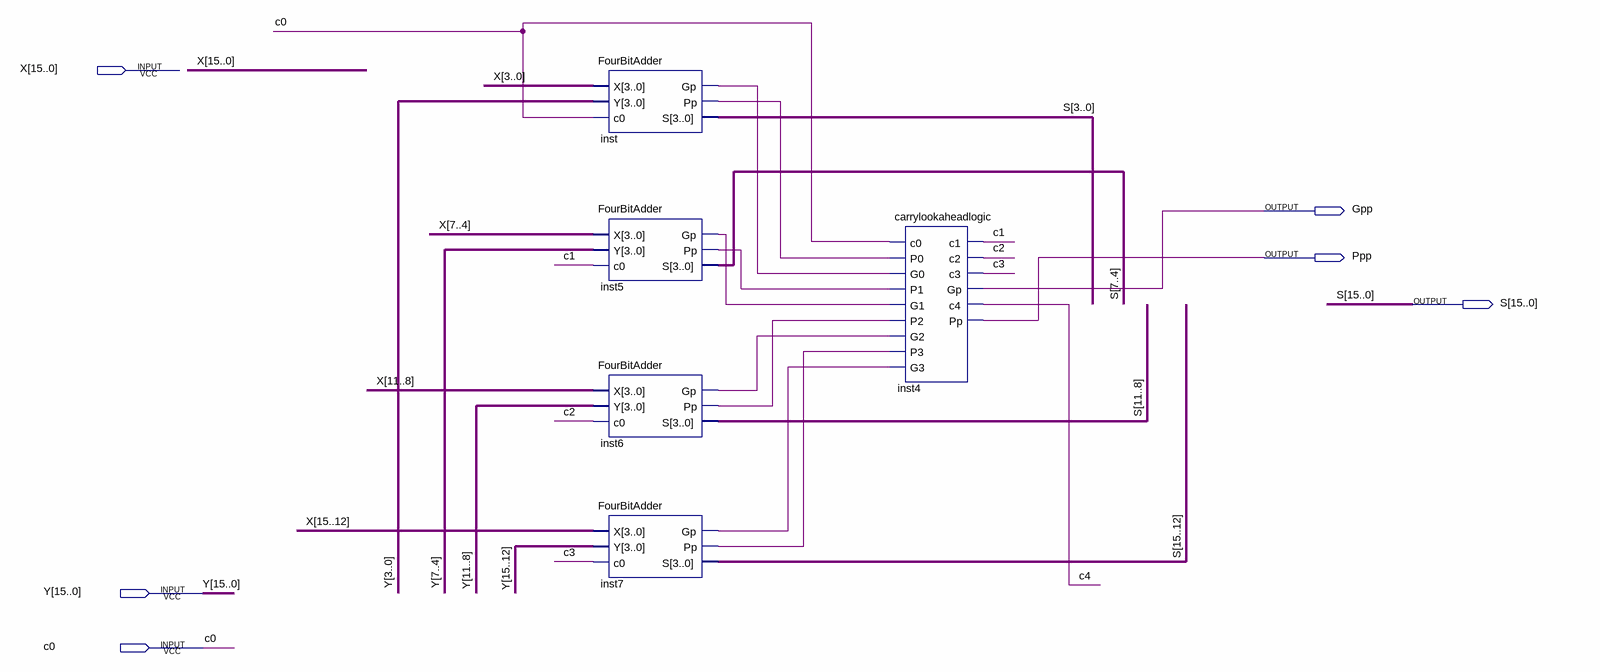
[diagram p0: schematic sheet]
// Quartus schematic SixteenBitAdder.bdf as structural Verilog: 5 symbols, 6 pins
module SixteenBitAdder (
  input  [15:0] X,
  input  [15:0] Y,
  input  c0,
  output Gpp,
  output Ppp,
  output [15:0] S
);

  wire c1, c2, c3, c4, inst5_gp, inst5_pp, inst6_gp, inst6_pp, inst7_gp, inst7_pp, inst_gp, inst_pp;

  FourBitAdder inst (.X(X[3:0]), .Y(Y[3:0]), .c0(c0), .Gp(inst_gp), .Pp(inst_pp), .S(S[3:0]));
  FourBitAdder inst5 (.X(X[7:4]), .Y(Y[7:4]), .c0(c1), .Gp(inst5_gp), .Pp(inst5_pp), .S(S[7:4]));
  FourBitAdder inst6 (.X(X[11:8]), .Y(Y[11:8]), .c0(c2), .Gp(inst6_gp), .Pp(inst6_pp), .S(S[11:8]));
  FourBitAdder inst7 (.X(X[15:12]), .Y(Y[15:12]), .c0(c3), .Gp(inst7_gp), .Pp(inst7_pp), .S(S[15:12]));
  carrylookaheadlogic inst4 (
    .c0(c0), .P0(inst_pp), .G0(inst_gp), .P1(inst5_pp), .G1(inst5_gp), .P2(inst6_pp), .G2(inst6_gp),
    .P3(inst7_pp), .G3(inst7_gp), .c1(c1), .c2(c2), .c3(c3), .Gp(Gpp), .c4(c4), .Pp(Ppp));
endmodule
